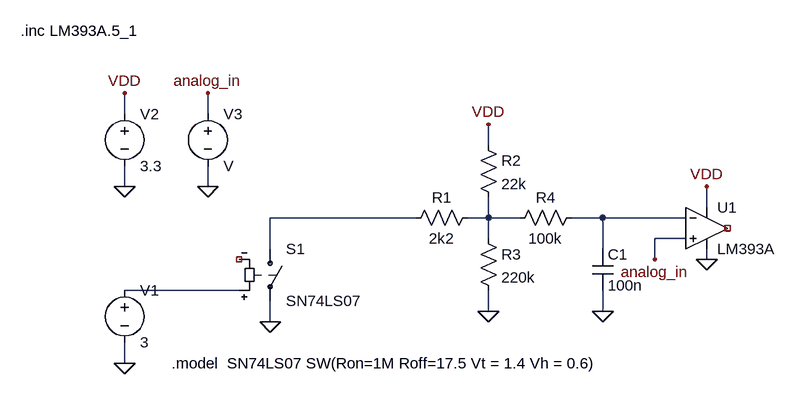
[diagram p0: schematic PR10.asc]
PR10.asc, the LTspice schematic file:
Version 4.1
SHEET 1 896 680
WIRE -112 -96 -112 -128
WIRE 16 -96 16 -128
WIRE 448 -48 448 -80
WIRE -112 16 -112 -16
WIRE 16 16 16 -16
WIRE 784 48 784 16
WIRE 336 64 112 64
WIRE 448 64 448 32
WIRE 448 64 416 64
WIRE 496 64 448 64
WIRE 624 64 576 64
WIRE 752 64 624 64
WIRE 448 96 448 64
WIRE 752 96 704 96
WIRE 112 112 112 64
WIRE 624 112 624 64
WIRE 704 128 704 96
WIRE 784 128 784 112
WIRE 64 176 -112 176
WIRE 448 208 448 176
WIRE 624 208 624 176
WIRE 112 224 112 192
WIRE -112 288 -112 256
FLAG 112 224 0
FLAG -112 288 0
FLAG 448 208 0
FLAG 448 -80 VDD
FLAG 624 208 0
FLAG -112 16 0
FLAG -112 -128 VDD
FLAG 784 16 VDD
FLAG 784 128 0
FLAG 16 16 0
FLAG 16 -128 analog_in
FLAG 704 128 analog_in
SYMBOL sw 112 96 R0
SYMATTR InstName S1
SYMATTR Value SN74LS07
SYMBOL voltage -112 160 R0
WINDOW 123 0 0 Left 0
WINDOW 39 0 0 Left 0
SYMATTR InstName V1
SYMATTR Value 3
SYMBOL res 432 48 R90
WINDOW 0 0 56 VBottom 2
WINDOW 3 32 56 VTop 2
SYMATTR InstName R1
SYMATTR Value 2k2
SYMBOL res 432 -64 R0
SYMATTR InstName R2
SYMATTR Value 22k
SYMBOL res 432 80 R0
SYMATTR InstName R3
SYMATTR Value 220k
SYMBOL res 592 48 R90
WINDOW 0 0 56 VBottom 2
WINDOW 3 32 56 VTop 2
SYMATTR InstName R4
SYMATTR Value 100k
SYMBOL cap 608 112 R0
SYMATTR InstName C1
SYMATTR Value 100n
SYMBOL voltage -112 -112 R0
WINDOW 123 0 0 Left 0
WINDOW 39 0 0 Left 0
SYMATTR InstName V2
SYMATTR Value 3.3
SYMBOL OpAmps\\opamp2 784 16 R0
SYMATTR InstName U1
SYMATTR Value LM393A
SYMBOL voltage 16 -112 R0
SYMATTR InstName V3
TEXT -40 288 Left 2 !.model  SN74LS07 SW(Ron=1M Roff=17.5 Vt = 1.4 Vh = 0.6)
TEXT -272 -224 Left 2 !.inc LM393A.5_1

The netlist it stands for:
* PR10.asc
S1 N001 0 N004 NC_01 SN74LS07
V1 N004 0 3
R1 N002 N001 2k2
R2 VDD N002 22k
R3 N002 0 220k
R4 N003 N002 100k
C1 N003 0 100n
V2 VDD 0 3.3
X§U1 analog_in N003 VDD 0 NC_02 LM393A  ; pins In+ In- V+ V- OUT
V3 analog_in 0 V
.model  SN74LS07 SW(Ron=1M Roff=17.5 Vt = 1.4 Vh = 0.6)
.inc LM393A.5_1
.backanno
.end